# EAGLE design avr-grundschaltung (EAGLE 5.01)
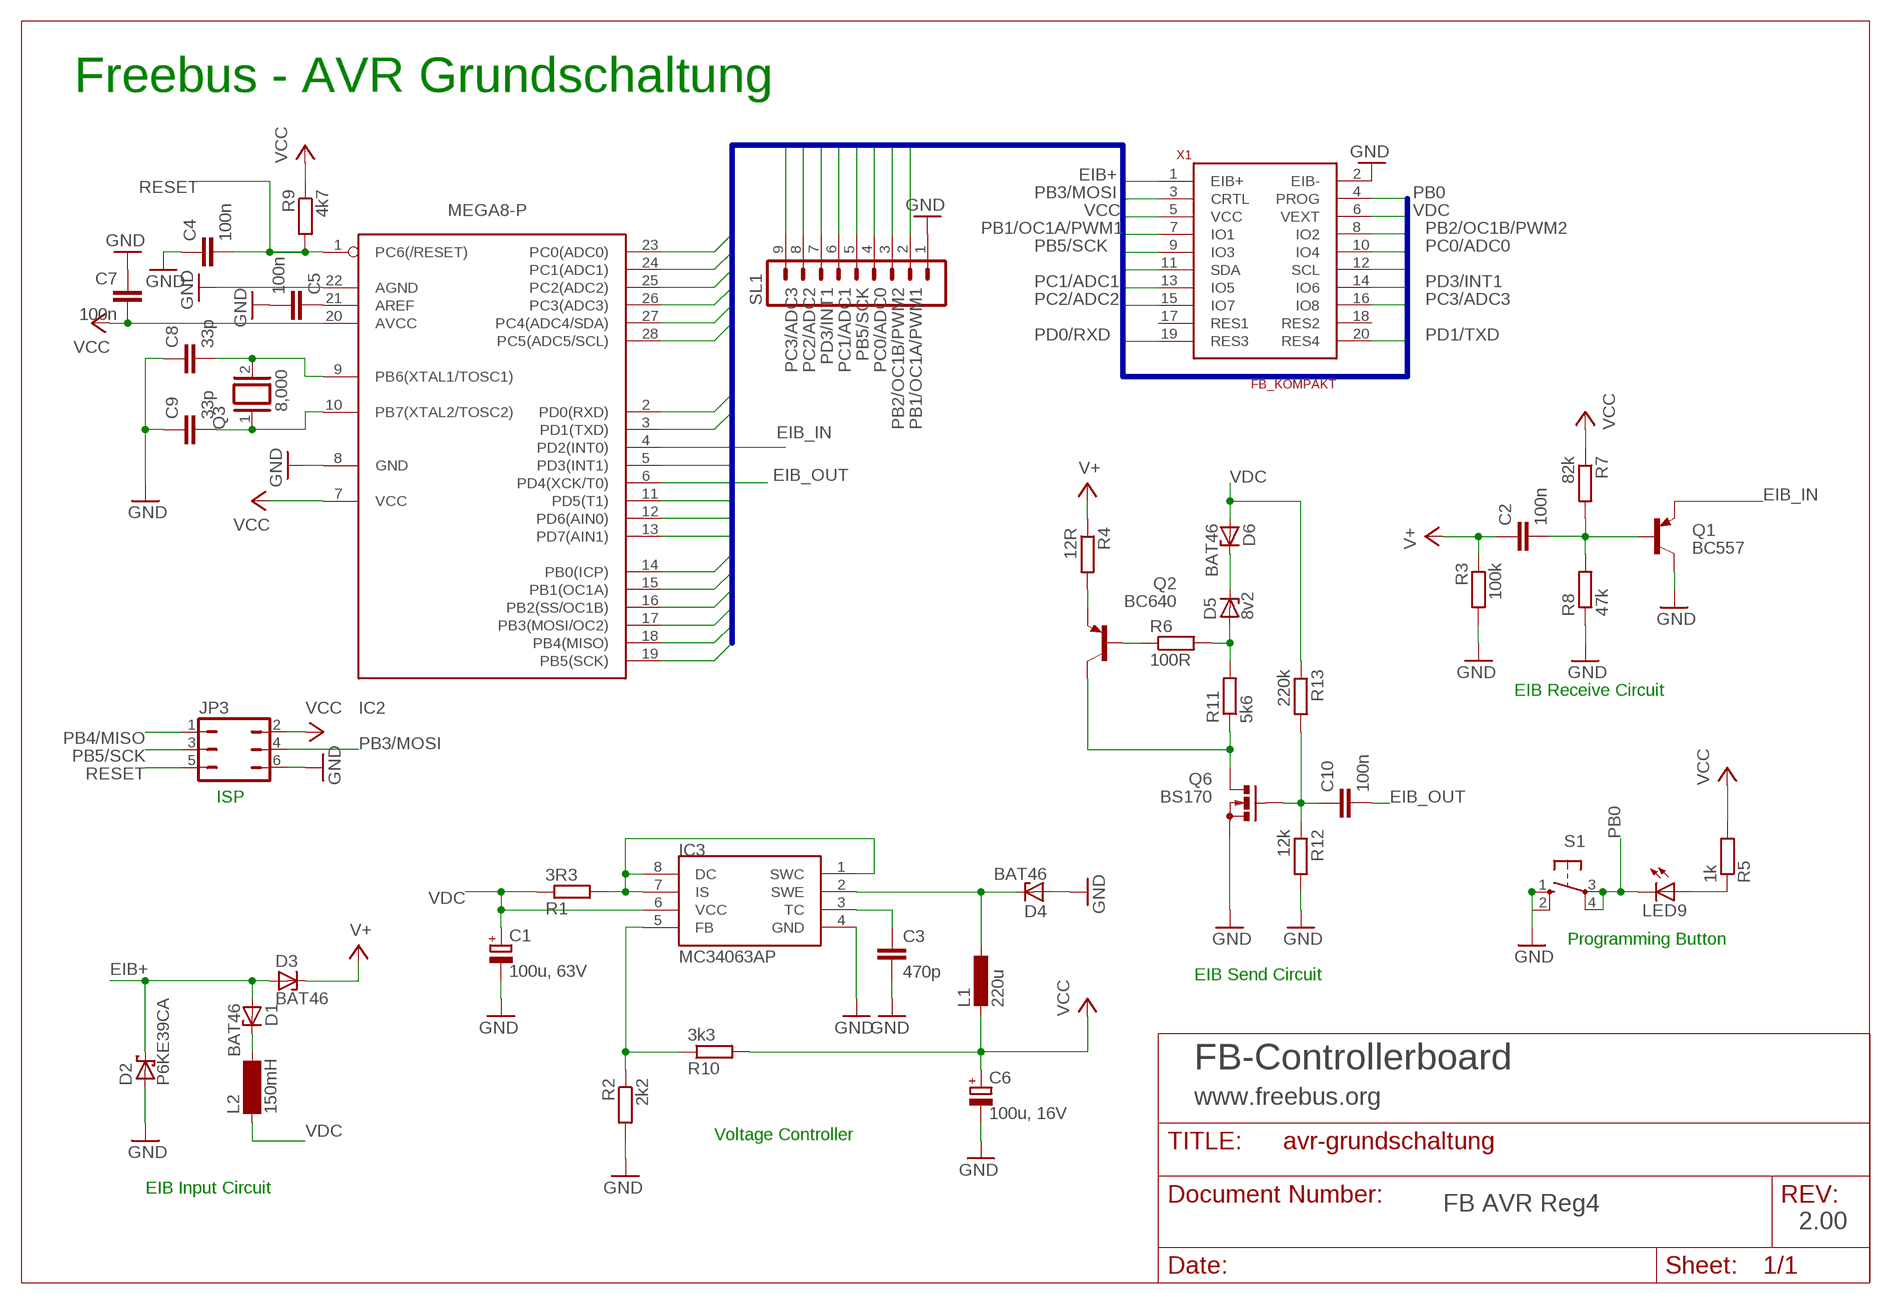
[diagram p0: schematic, sheet 1]

## Parts
C1  100u, 63V  CPOL-EUE5-10.5  [E5-10,5]
C2  100n  C-EU050-025X075  [C050-025X075]
C3  470p  C-EU025-024X044  [C025-024X044]
C4  100n  C-EU050-024X044  [C050-024X044]
C5  100n  C-EU050-025X075  [C050-025X075]
C6  100u, 16V  CPOL-EUE2.5-7  [E2,5-7]
C7  100n  C-EU050-025X075  [C050-025X075]
C8  33p  C-EU025-025X050  [C025-025X050]
C9  33p  C-EU025-025X050  [C025-025X050]
C10  100n  C-EU050-025X075  [C050-025X075]
D1  BAT46  1N821  [DO35Z10]
D2  P6KE39CA  P6KEXXA  [C1702-15]
D3  BAT46  1N821  [DO35Z10]
D4  BAT46  1N821  [DO35Z10]
D5  8v2  BZX90  [DO34Z7]
D6  BAT46  1N821  [DO35Z10]
IC2  MEGA8-P  [DIL28-3]
IC3  MC34063AP  [DIL08]
JP3  JP3Q  [JP3Q]
L1  220u  L-EU0207/12  [0207/12]
L2  150mH  SD12-1000  [SD12_1000]
LED9  LED3MM  [LED3MM]
Q1  BC557  [TO92]
Q2  BC640  [TO92-BCE]
Q3  8,000  XTAL/S  [QS]
Q6  BS170  [SOT54E]
R1  3R3  R-EU_0207/2V  [0207/2V]
R2  2k2  R-EU_0207/10  [0207/10]
R3  100k  R-EU_0207/10  [0207/10]
R4  12R  R-EU_0207/10  [0207/10]
R5  1k  R-EU_0207/2V  [0207/2V]
R6  100R  R-EU_0207/10  [0207/10]
R7  82k  R-EU_0207/10  [0207/10]
R8  47k  R-EU_0207/10  [0207/10]
R9  4k7  R-EU_0207/10  [0207/10]
R10  3k3  R-EU_0207/5V  [0207/5V]
R11  5k6  R-EU_0207/10  [0207/10]
R12  12k  R-EU_0207/10  [0207/10]
R13  220k  R-EU_0207/10  [0207/10]
S1  10-XX  [B3F-10XX]
SL1  M09  [09P]
X1  FB_KOMPAKT  [ML20]

## Nets
EIB+: D1.A D2.C D3.A X1.1(EIB+)
EIB_IN: IC2.4(PD2(INT0)) Q1.1(E)
EIB_OUT: C10.2 IC2.6(PD4(XCK/T0))
GND: C1.- C3.2 C4.1 C5.2 C6.- C7.1 C8.1 C9.1 D2.A D4.A IC2.8(GND) IC2.22(AGND) IC3.4(GND) JP3.6 Q1.3(C) Q6.S R2.2 R3.2 R8.1 R12.2 S1.1(S) S1.2(S1) SL1.1 X1.2(EIB-)
N$1: Q2.E R4.2
N$2: D5.C D6.C
N$3: C10.1 Q6.G R12.1 R13.2
N$4: Q2.B R6.1
N$5: Q2.C Q6.D R11.1
N$6: D1.C L2.2
N$7 [supply]: C2.2 Q1.2(B) R7.2 R8.2
N$8: C8.2 IC2.9(PB6(XTAL1/TOSC1)) Q3.2
N$9: C9.2 IC2.10(PB7(XTAL2/TOSC2)) Q3.1
N$10: D5.A R6.2 R11.2
N$12: IC3.1(SWC) IC3.7(IS) IC3.8(DC) R1.2
N$19: LED9.A R5.1
N$20: D4.C IC3.2(SWE) L1.1
N$21: C3.1 IC3.3(TC)
N$22: IC3.5(FB) R2.1 R10.1
N$24: C5.1 IC2.21(AREF)
PB0: IC2.14(PB0(ICP)) LED9.K(C) S1.3(P) S1.4(P1) X1.4(PROG)
PB1/OC1A/PWM1: IC2.15(PB1(OC1A)) SL1.2 X1.7(IO1)
PB2/OC1B/PWM2: IC2.16(PB2(SS/OC1B)) SL1.3 X1.8(IO2)
PB3/MOSI: IC2.17(PB3(MOSI/OC2)) JP3.4 X1.3(CRTL)
PB4/MISO: IC2.18(PB4(MISO)) JP3.1
PB5/SCK: IC2.19(PB5(SCK)) JP3.3 SL1.5 X1.9(IO3)
PC0/ADC0: IC2.23(PC0(ADC0)) SL1.4 X1.10(IO4)
PC1/ADC1: IC2.24(PC1(ADC1)) SL1.6 X1.13(IO5)
PC2/ADC2: IC2.25(PC2(ADC2)) SL1.8 X1.15(IO7)
PC3/ADC3: IC2.26(PC3(ADC3)) SL1.9 X1.16(IO8)
PC4/ADC4/SDA: IC2.27(PC4(ADC4/SDA)) X1.11(SDA)
PC5/ADC5/SCL: IC2.28(PC5(ADC5/SCL)) X1.12(SCL)
PD0/RXD: IC2.2(PD0(RXD)) X1.19(RES3)
PD1/TXD: IC2.3(PD1(TXD)) X1.20(RES4)
PD3/INT1: IC2.5(PD3(INT1)) SL1.7 X1.14(IO6)
PD5/T1: IC2.11(PD5(T1))
PD6/AIN0: IC2.12(PD6(AIN0))
PD7/AIN1: IC2.13(PD7(AIN1))
RESET: C4.2 IC2.1(PC6(/RESET)) JP3.5 R9.2
V+: C2.1 D3.C R3.1 R4.1
VCC: C6.+ C7.2 IC2.7(VCC) IC2.20(AVCC) JP3.2 L1.2 R5.2 R7.1 R9.1 R10.2 X1.5(VCC)
VDC [supply]: C1.+ D6.A IC3.6(VCC) L2.1 R1.1 R13.1 X1.6(VEXT)
Unconnected: X1.17(RES1) X1.18(RES2)

## Buses
PC0/ADC0,PC1/ADC1,PC2/ADC2,PC3/ADC3,PC4/ADC4/SDA,PC5/ADC5/SCL,PD0/RXD,PD1/TXD,EIB+,PB1/OC1A/PWM1,PB2/OC1B/PWM2,VEXT,PB0,PB5/SCK,VCC,PD3/INT1,PD5/T1,PD6/AIN0,PD7/AIN1,PB3/MOSI,PB4/MISO,PB5/SCK

## Notes on the sheet
- Freebus - AVR Grundschaltung
- EIB Receive Circuit
- ISP
- Programming Button
- EIB Send Circuit
- FB-Controllerboard
- www.freebus.org
- Voltage Controller
- EIB Input Circuit
- FB AVR Reg4
- 2.00

## Library data of the parts
C1 C6 = rcl:CPOL-EU: POLARIZED CAPACITOR, European symbol
C2-C5 C7-C10 = rcl:C-EU: CAPACITOR, European symbol
D1 D3 D4 D6 = diode:1N821: Reference DIODE temperature compensated, 6,2 V
D2 = diode:P6KEXXA: DIODE transient-voltage suppressor
D5 = diode:BZX90: Z DIODE
IC2 = atmel:MEGA8-P: MICROCONTROLLER 8 Kbytes FLASH, 1 kbytes SRAM, 512 bytes EEPROM, USART, 4-channel 10 bit ADC, 2-channel 8 bit ADC Pin compatible with Atmega48, ATMega88, ATMega168 Source: avr.lbr
IC3 = mc34063:MC34063
JP3 = jumper:JP3Q: JUMPER
L1 = rcl:L-EU: INDUCTOR, European symbol
L2 = inductor-neosid:SD12: INDUCTOR nominal inductance
LED9 = led:LED: LED OSRAM: - CHIPLED LG R971, LG N971, LY N971, LG Q971, LY Q971, LO R971, LY R971 LH N974, LH R974 LS Q976, LO Q976, LY Q976 LO Q996 - Hyper CHIPLED LW Q18S LB Q993, LB Q99A, LB R99A - SideLED LS A670, LO A670, LY A670, LG A670, LP A670 LB A673, LV A673, LT A673, LW A673 LH A674 LY A675 LS A676, LA A676, LO A676, LY A676, LW A676 LS A679, LY A679, LG A679 - Hyper Micro SIDELED® LS Y876, LA Y876, LO Y876, LY Y876 LT Y87S - SmartLED LW L88C, LW L88S LB L89C, LB L89S, LG L890 LS L89K, LO L89K, LY L89K LS L896, LA L896, LO L896, LY L896 - TOPLED LS T670, LO T670, LY T670, LG T670, LP T670 LSG T670, LSP T670, LSY T670, LOP T670, LYG T670 LG T671, LOG T671, LSG T671 LB T673, LV T673, LT T673, LW T673 LH T674 LS T676, LA T676, LO T676, LY T676, LB T676, LH T676, LSB T676, LW T676 LB T67C, LV T67C, LT T67C, LS T67K, LO T67K, LY T67K, LW E67C LS E67B, LA E67B, LO E67B, LY E67B, LB E67C, LV E67C, LT E67C LW T67C LS T679, LY T679, LG T679 LS T770, LO T770, LY T770, LG T770, LP T770 LB T773, LV T773, LT T773, LW T773 LH T774 LS E675, LA E675, LY E675, LS T675 LS T776, LA T776, LO T776, LY T776, LB T776 LHGB T686 LT T68C, LB T68C - Hyper Mini TOPLED® LB M676 - Mini TOPLED Santana® LG M470 LS M47K, LO M47K, LY M47K Source: http://www.osram.convergy.de LUXEON: - LUMILED® LXK2-PW12-R00, LXK2-PW12-S00, LXK2-PW14-U00, LXK2-PW14-V00 LXK2-PM12-R00, LXK2-PM12-S00, LXK2-PM14-U00 LXK2-PE12-Q00, LXK2-PE12-R00, LXK2-PE12-S00, LXK2-PE14-T00, LXK2-PE14-U00 LXK2-PB12-K00, LXK2-PB12-L00, LXK2-PB12-M00, LXK2-PB14-N00, LXK2-PB14-P00, LXK2-PB14-Q00 LXK2-PR12-L00, LXK2-PR12-M00, LXK2-PR14-Q00, LXK2-PR14-R00 LXK2-PD12-Q00, LXK2-PD12-R00, LXK2-PD12-S00 LXK2-PH12-R00, LXK2-PH12-S00 LXK2-PL12-P00, LXK2-PL12-Q00, LXK2-PL12-R00 Source: www.luxeon.com KINGBRIGHT: KA-3528ASYC Source: www.kingbright.com
Q1 = transistor-pnp:BC557: PNP Transistor
Q2 = transistor-pnp:BC640*: PNP Transistror
Q3 = special:XTAL/S: CRYSTAL
Q6 = transistor-small-signal:BS170: N-CHANNEL MOS FET
R1-R13 = rcl:R-EU_: RESISTOR, European symbol
S1 = switch-omron:10-XX: OMRON SWITCH
SL1 = con-amp-quick:M09: AMP QUICK CONNECTOR
X1 = EIB_Freebus:FB_KOMPAKT: Steckverbinder für Controller <--> Anwendung Kompaktversion Vorteile: - Das Symbol im Schaltplan sieht so aus wie auf dem PCB - Vielleicht schneller zu überblicken, was an welchem Pin angeschlossen ist Nachteile: - Viele unnötige Leitungen im Schaltplan notwendig

## Net classes
0 default: width 0.406 mm
1 supply: width 0.406 mm

## Board
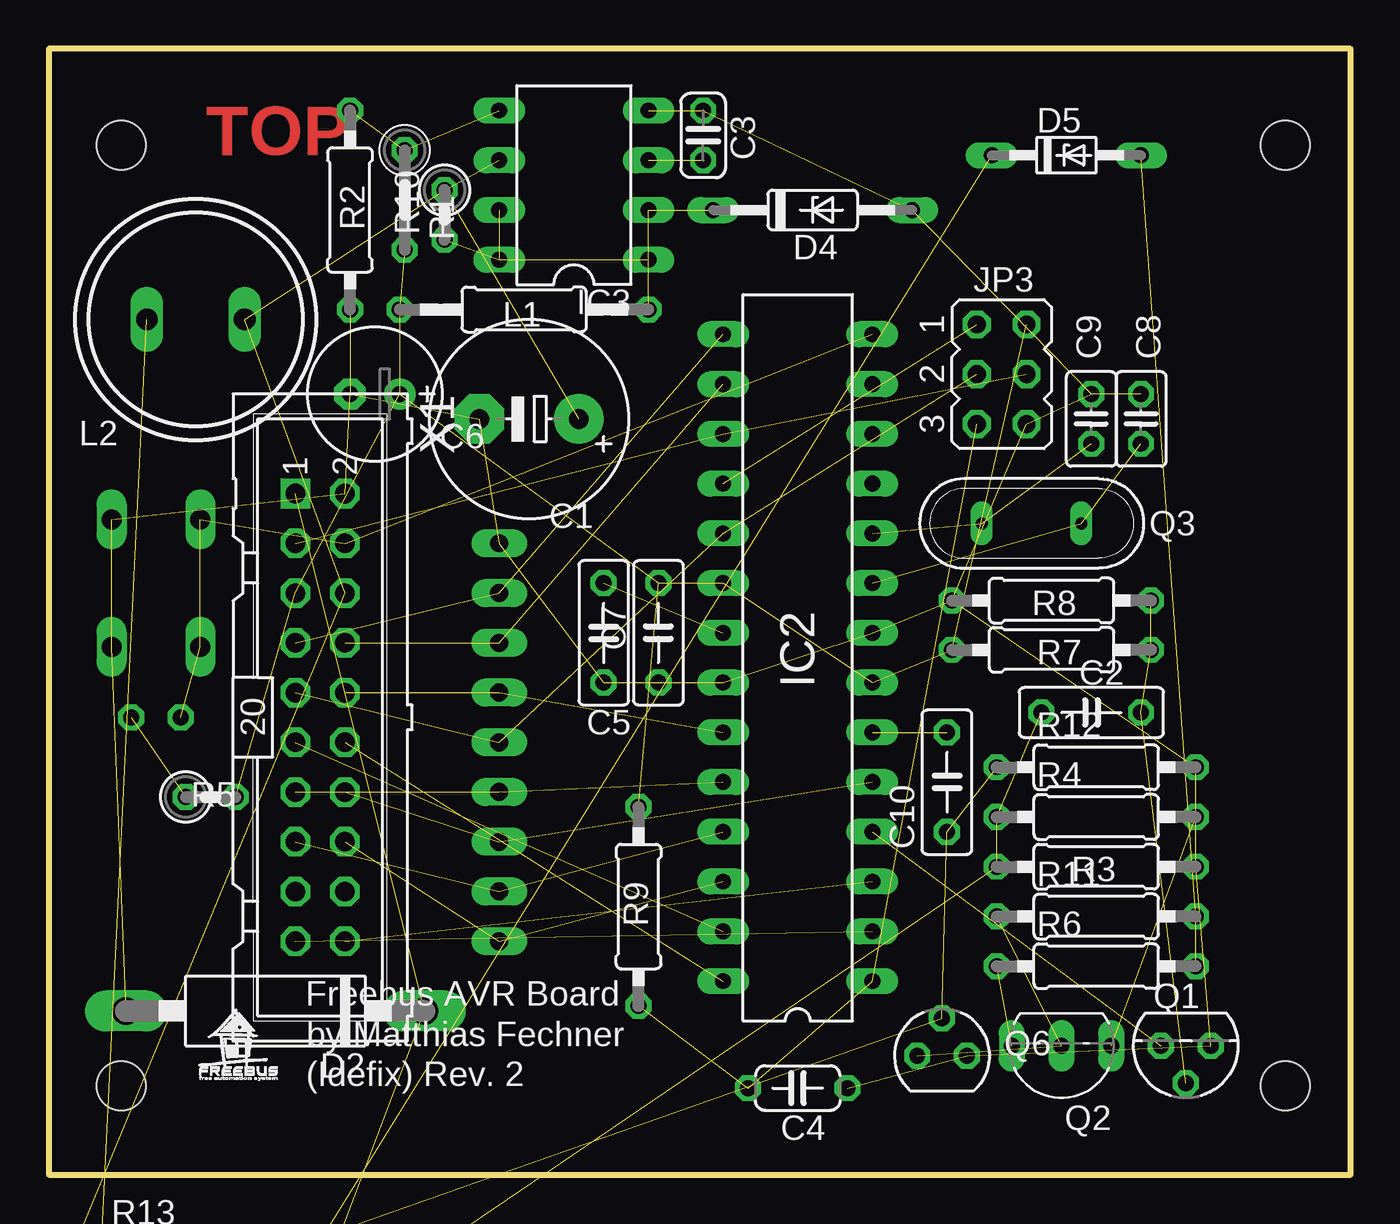
[diagram p1: board, top side]
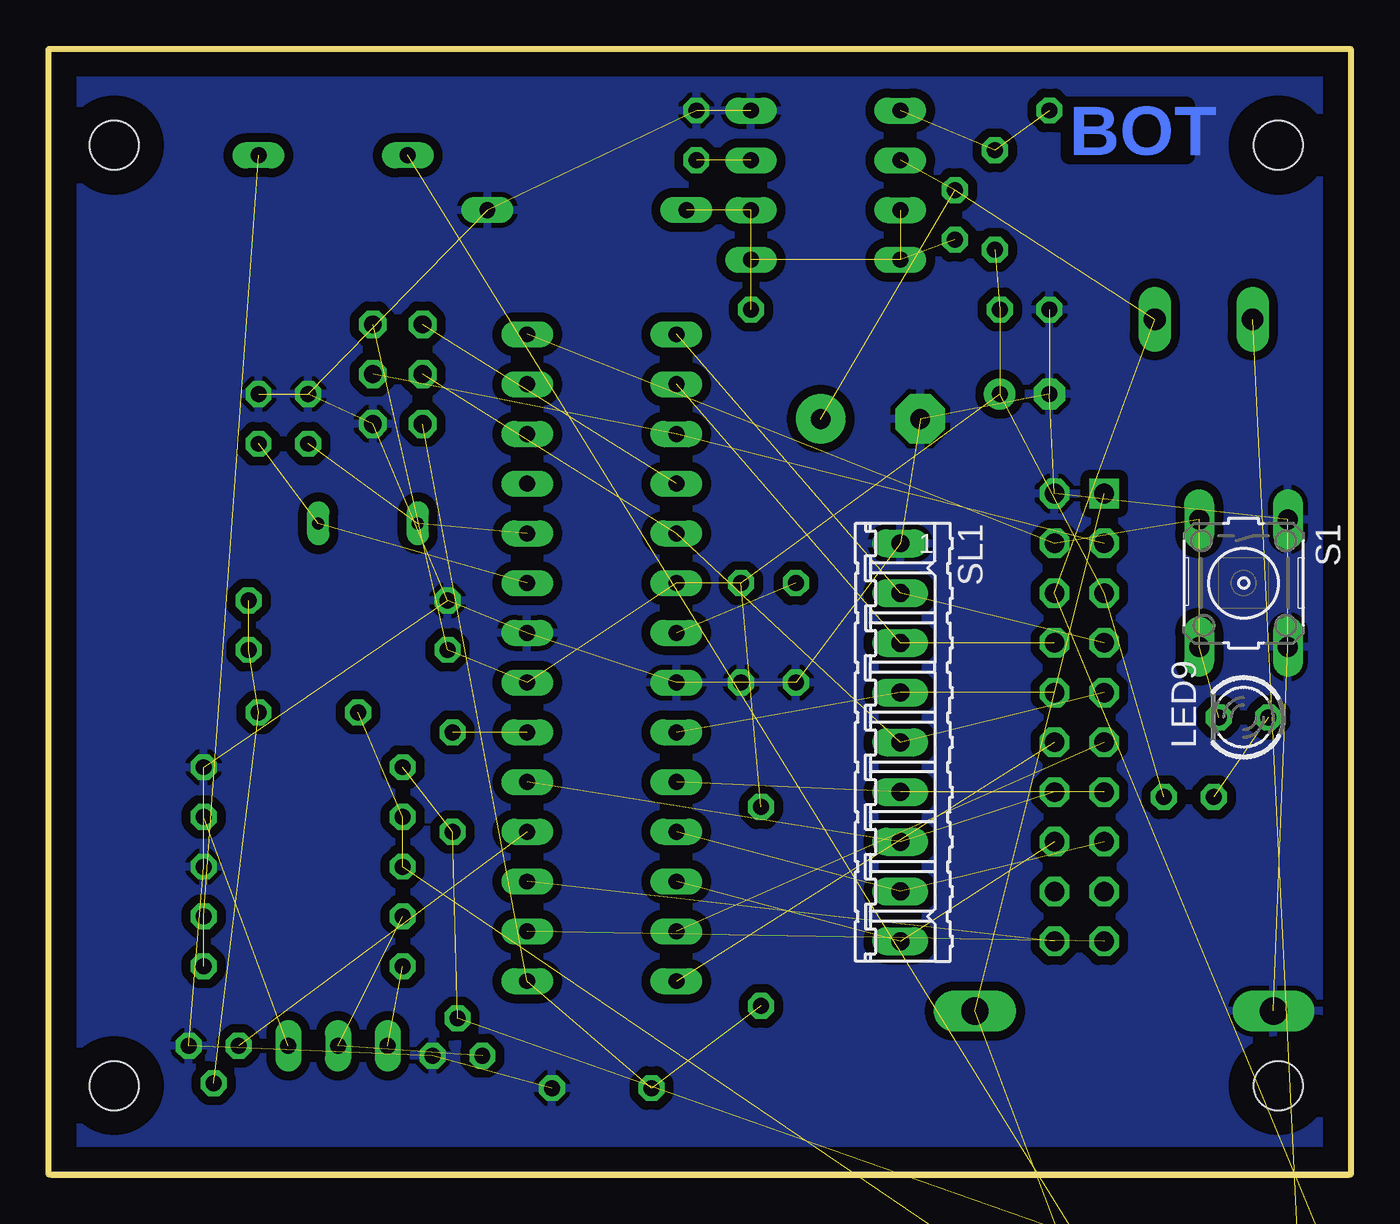
[diagram p2: board, bottom side, seen from below]

Size 66.45 x 57.47 mm. Coordinates in mm from the lower left corner, seen from the top.
Outline: 0,57.47 0,0 66.45,0 66.45,57.47 0,57.47
Copper layers (1*16): Top 0.035mm / dielectric 1.5mm / Bottom 0.035mm
Design rules "idefix-default *": minimum track width 10mil, minimum drill 24mil, track to track 18mil, track to pad 12mil, pad to pad 8mil, via to via 12mil, smd to smd 8mil, copper to edge 50mil, drill to drill 45mil, minimum pad ring 10mil, minimum via ring 8mil, stop-mask expansion 4mil, vias tented up to drill 0mil, thermal gap 10mil
Holes 2.5 mm at 3.68,52.55 63.12,4.54 63.12,52.55 3.68,4.54
Milling: 4 lines

### Footprints (pad centres in the part's own frame; a part is rotated, then mirrored left to right if it is on the bottom)
E5-10,5 = drill 1.016 pad 2.54 round: + -2.54,0 | drill 1.016 pad 2.54 octagon: - 2.54,0
C050-025X075 = drill 0.813 octagon: 1 -2.54,0; 2 2.54,0
C025-024X044 = drill 0.813 octagon: 1 -1.27,0; 2 1.27,0
C050-024X044 = drill 0.813 octagon: 1 -2.54,0; 2 2.54,0
E2,5-7 = drill 0.813 pad 1.6 round: + -1.27,0 | drill 0.813 pad 1.6 octagon: - 1.27,0
C025-025X050 = drill 0.813 octagon: 1 -1.27,0; 2 1.27,0
DO35Z10 = drill 0.813 long: A 5.08,0; C -5.08,0
C1702-15 = drill 1.397 long: A 7.62,0; C -7.62,0
DO34Z7 = drill 0.813 long: A 3.81,0; C -3.81,0
DIL28-3 = drill 0.813 long: 1 -16.51,-3.81; 2 -13.97,-3.81; 3 -11.43,-3.81; 4 -8.89,-3.81; 5 -6.35,-3.81; 6 -3.81,-3.81; 7 -1.27,-3.81; 8 1.27,-3.81; 9 3.81,-3.81; 10 6.35,-3.81; 11 8.89,-3.81; 12 11.43,-3.81; 13 13.97,-3.81; 14 16.51,-3.81; 15 16.51,3.81; 16 13.97,3.81; 17 11.43,3.81; 18 8.89,3.81; 19 6.35,3.81; 20 3.81,3.81; 21 1.27,3.81; 22 -1.27,3.81; 23 -3.81,3.81; 24 -6.35,3.81; 25 -8.89,3.81; 26 -11.43,3.81; 27 -13.97,3.81; 28 -16.51,3.81
DIL08 = drill 0.813 long: 1 -3.81,-3.81; 2 -1.27,-3.81; 3 1.27,-3.81; 4 3.81,-3.81; 5 3.81,3.81; 6 1.27,3.81; 7 -1.27,3.81; 8 -3.81,3.81
JP3Q = drill 0.914 octagon: 1 -2.54,-1.27; 2 -2.54,1.27; 3 0,-1.27; 4 0,1.27; 5 2.54,-1.27; 6 2.54,1.27
0207/12 = drill 0.813 octagon: 1 -6.35,0; 2 6.35,0
SD12_1000 = drill 1.1 long: 1 -2.5,0; 2 2.5,0
LED3MM = drill 0.813 octagon: A -1.27,0; K 1.27,0
TO92 = drill 0.813 octagon: 1 1.27,0; 2 0,1.905; 3 -1.27,0
TO92-BCE = drill 0.813 long: B 2.54,0; C 0,0; E -2.54,0
QS = drill 0.61 long: 1 -2.54,0; 2 2.54,0
SOT54E = drill 0.813 octagon: D -1.27,0; G 0,1.905; S 1.27,0
0207/2V = drill 0.813 octagon: 1 -1.27,0; 2 1.27,0
0207/10 = drill 0.813 octagon: 1 -5.08,0; 2 5.08,0
0207/5V = drill 0.813 octagon: 1 -2.54,0; 2 2.54,0
B3F-10XX = drill 1.016 long: 1 -3.251,2.261; 2 3.251,2.261; 3 -3.251,-2.261; 4 3.251,-2.261
09P = drill 0.914 long: 1 -10.16,0; 2 -7.62,0; 3 -5.08,0; 4 -2.54,0; 5 0,0; 6 2.54,0; 7 5.08,0; 8 7.62,0; 9 10.16,0
ML20 = drill 1 square: 1 -11.43,-1.27 | drill 1 octagon: 2 -11.43,1.27; 3 -8.89,-1.27; 4 -8.89,1.27; 5 -6.35,-1.27; 6 -6.35,1.27; 7 -3.81,-1.27; 8 -3.81,1.27; 9 -1.27,-1.27; 10 -1.27,1.27; 11 1.27,-1.27; 12 1.27,1.27; 13 3.81,-1.27; 14 3.81,1.27; 15 6.35,-1.27; 16 6.35,1.27; 17 8.89,-1.27; 18 8.89,1.27; 19 11.43,-1.27; 20 11.43,1.27

### Placement (x,y rotation side)
C1  24.51,38.58 180 top
C2  53.21,23.59 0 top
C3  33.4,53.06 90 top
C4  38.23,4.42 180 top
C5  28.32,27.66 270 top
C6  16.64,39.85 180 top
C7  31.11,27.66 90 top
C8  55.75,38.58 270 top
C9  53.21,38.58 270 top
C10  45.85,20.04 90 top
D1  7.49,-9.17 0 top  (outside the outline)
D2  11.56,8.35 180 top
D3  7.49,-15.52 0 top  (outside the outline)
D4  38.99,49.25 0 top
D5  51.94,52.04 0 top
D6  7.49,-21.87 0 top  (outside the outline)
IC2  38.23,26.39 90 top
IC3  26.8,50.52 90 top
JP3  48.64,40.87 270 top
L1  24.26,44.17 180 top
L2  7.49,43.66 180 top
LED9  5.46,23.34 180 bottom
Q1  58.04,6.58 180 top
Q2  51.69,6.58 180 top
Q3  50.16,33.25 0 top
Q6  45.59,6.07 0 top
R1  20.19,48.99 270 top
R2  15.37,49.25 270 top
R3  53.47,15.72 0 top
R4  53.47,18.26 0 top
R5  8.25,19.28 0 top
R6  53.47,10.64 0 top
R7  51.18,26.79 0 top
R8  51.18,29.31 0 top
R9  30.1,13.69 270 top
R10  18.16,49.76 270 top
R11  53.47,13.18 0 top
R12  53.47,20.8 0 top
R13  6.22,-4.09 0 top  (outside the outline)
S1  5.46,30.2 270 bottom
SL1  22.99,22.07 270 bottom
U$1  [FREEBUS_LOGO]  9.62,6.21 0 top
X1  13.84,23.34 270 top

### Tracks (layer width: path | path; a pad name or v marks a point on that pad's centre or on a via)
EIB+  (3 unrouted)
EIB_IN  (1 unrouted)
EIB_OUT  (1 unrouted)
GND  (23 unrouted)
  pour Bottom: 0.38,57.02 66.01,57.02 66.01,0.43 0.38,0.43
N$1  (1 unrouted)
N$2  (1 unrouted)
N$3  (3 unrouted)
N$4  (1 unrouted)
N$5  (2 unrouted)
N$6  (1 unrouted)
N$7  (3 unrouted)
N$8  (2 unrouted)
N$9  (2 unrouted)
N$10  (2 unrouted)
N$12  (3 unrouted)
N$19  (1 unrouted)
N$20  (2 unrouted)
N$21  (1 unrouted)
N$22  (2 unrouted)
N$24  (1 unrouted)
PB0  (4 unrouted)
PB1/OC1A/PWM1  (2 unrouted)
PB2/OC1B/PWM2  (2 unrouted)
PB3/MOSI  (2 unrouted)
PB4/MISO  (1 unrouted)
PB5/SCK  (3 unrouted)
PC0/ADC0  (2 unrouted)
PC1/ADC1  (2 unrouted)
PC2/ADC2  (2 unrouted)
PC3/ADC3  (2 unrouted)
PC4/ADC4/SDA  (1 unrouted)
PC5/ADC5/SCL  (1 unrouted)
PD0/RXD  (1 unrouted)
PD1/TXD  (1 unrouted)
PD3/INT1  (2 unrouted)
RESET  (3 unrouted)
V+  (3 unrouted)
VCC  (10 unrouted)
VDC  (6 unrouted)

### Text on the board
Top: TOP
Bottom: BOT
tNames: Freebus AVR Board | by Matthias Fechner | (Idefix) Rev. 2